# EAGLE schematic AND_1_1 (EAGLE 8.3.2)
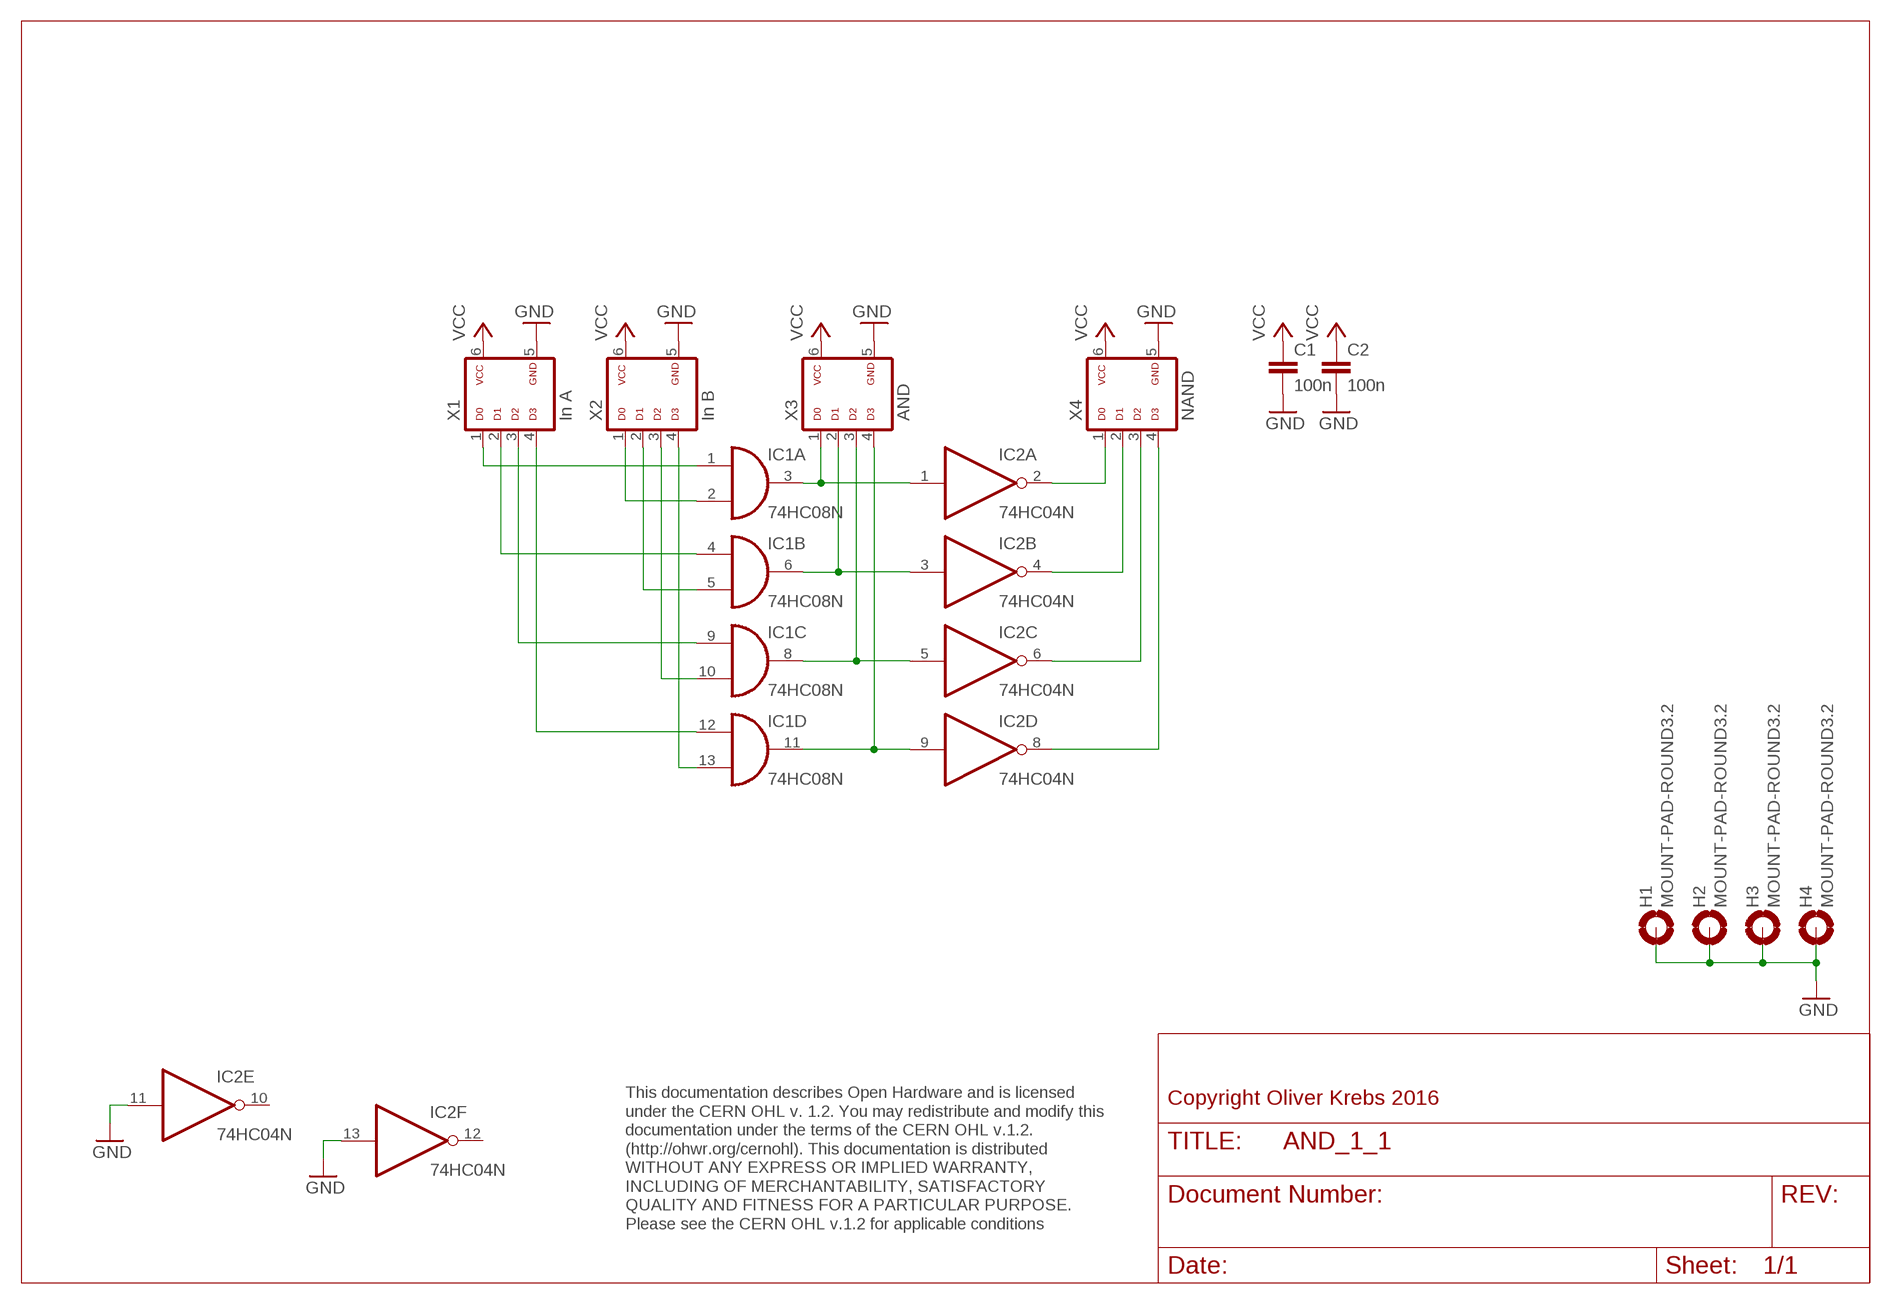
[diagram p0: schematic, sheet 1]

## Parts
C1  100n  C-EU050-025X075  [C050-025X075]
C2  100n  C-EU050-025X075  [C050-025X075]
H1  MOUNT-PAD-ROUND3.2  [3,2-PAD]
H2  MOUNT-PAD-ROUND3.2  [3,2-PAD]
H3  MOUNT-PAD-ROUND3.2  [3,2-PAD]
H4  MOUNT-PAD-ROUND3.2  [3,2-PAD]
IC1  74HC08N  [DIL14]
IC2  74HC04N  [DIL14]
X1  In A  ML6D  [ML-6]
X2  In B  ML6D  [ML-6]
X3  AND  ML6D  [ML-6]
X4  NAND  ML6D  [ML-6]

## Nets
GND: C1.2 C2.2 H1.B3,2(MOUNT) H2.B3,2(MOUNT) H3.B3,2(MOUNT) H4.B3,2(MOUNT) IC2.11(E:I) IC2.13(F:I) X1.5 X2.5 X3.5 X4.5
N$1: IC1.3(A:O) IC2.1(A:I) X3.1
N$2: IC1.6(B:O) IC2.3(B:I) X3.2
N$3: IC1.8(C:O) IC2.5(C:I) X3.3
N$4: IC1.11(D:O) IC2.9(D:I) X3.4
N$5: IC2.2(A:O) X4.1
N$6: IC2.4(B:O) X4.2
N$7: IC2.6(C:O) X4.3
N$8: IC2.8(D:O) X4.4
N$9: IC1.1(A:I0) X1.1
N$10: IC1.2(A:I1) X2.1
N$11: IC1.5(B:I1) X2.2
N$12: IC1.4(B:I0) X1.2
N$13: IC1.9(C:I0) X1.3
N$14: IC1.10(C:I1) X2.3
N$15: IC1.12(D:I0) X1.4
N$16: IC1.13(D:I1) X2.4
VCC: C1.1 C2.1 X1.6 X2.6 X3.6 X4.6
Unconnected: IC2.10(E:O) IC2.12(F:O)

## Notes on the sheet
- Copyright Oliver Krebs 2016
- This documentation describes Open Hardware and is licensed 
  under the CERN OHL v. 1.2. You may redistribute and modify this 
  documentation under the terms of the CERN OHL v.1.2. 
  (http://ohwr.org/cernohl). This documentation is distributed
  WITHOUT ANY EXPRESS OR IMPLIED WARRANTY, 
  INCLUDING OF MERCHANTABILITY, SATISFACTORY 
  QUALITY AND FITNESS FOR A PARTICULAR PURPOSE. 
  Please see the CERN OHL v.1.2 for applicable conditions

## Power pins joined to a net without a drawn wire
GND: IC1.7(P:GND) IC2.7(P:GND)
VCC: IC1.14(P:VCC) IC2.14(P:VCC)

## Library data of the parts
C1 C2 = 01-my_rcl:C-EU: CAPACITOR, European symbol
H1-H4 = holes:MOUNT-PAD-ROUND: MOUNTING PAD, round
IC1 = 74xx-eu:74*08: Quad 2-input AND gate
IC2 = 74xx-eu:74*04: Hex INVERTER
X1-X4 = 01-my-con:ML6D